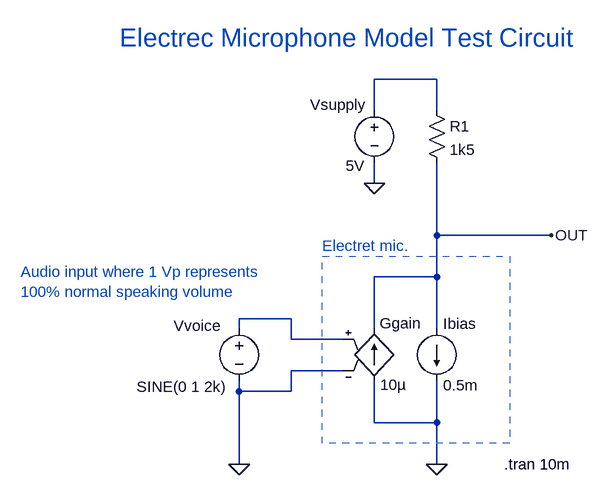
[diagram p0: schematic ElectretMicrophone.asc]
ElectretMicrophone.asc, the LTspice schematic file:
Version 4
SHEET 1 880 680
WIRE 192 -240 96 -240
WIRE 96 -192 96 -240
WIRE 192 -192 192 -240
WIRE 96 -80 96 -112
WIRE 192 0 192 -112
WIRE 368 0 192 0
WIRE 192 64 192 0
WIRE 192 64 96 64
WIRE -32 128 -112 128
WIRE -112 144 -112 128
WIRE 96 144 96 64
WIRE 192 144 192 64
WIRE -32 160 -32 128
WIRE 48 160 -32 160
WIRE 48 208 -32 208
WIRE -112 240 -112 224
WIRE -32 240 -32 208
WIRE -32 240 -112 240
WIRE 96 288 96 224
WIRE 192 288 192 224
WIRE 192 288 96 288
WIRE -112 352 -112 240
WIRE 192 352 192 288
FLAG 192 352 0
FLAG 368 0 OUT
FLAG -112 352 0
FLAG 96 -80 0
SYMBOL g 96 128 R0
WINDOW 0 8 7 Left 2
WINDOW 3 9 102 Left 2
SYMATTR InstName Ggain
SYMATTR Value 10µ
SYMBOL current 192 144 R0
WINDOW 0 10 -8 Left 2
WINDOW 3 10 87 Left 2
WINDOW 123 0 0 Left 0
WINDOW 39 0 0 Left 0
SYMATTR InstName Ibias
SYMATTR Value 0.5m
SYMBOL res 176 -208 R0
SYMATTR InstName R1
SYMATTR Value 1k5
SYMBOL voltage -112 128 R0
WINDOW 0 -101 11 Left 2
WINDOW 3 -158 105 Left 2
WINDOW 123 0 0 Left 0
WINDOW 39 0 0 Left 0
SYMATTR InstName Vvoice
SYMATTR Value SINE(0 1 2k)
SYMBOL voltage 96 -208 R0
WINDOW 0 -99 7 Left 2
WINDOW 3 -44 101 Left 2
WINDOW 123 0 0 Left 0
WINDOW 39 0 0 Left 0
SYMATTR InstName Vsupply
SYMATTR Value 5V
TEXT 296 352 Left 2 !.tran 10m
TEXT -296 -304 Left 4 ;Electrec Microphone Model Test Circuit
TEXT -448 56 Left 2 ;Audio input where 1 Vp represents \n100% normal speaking volume
TEXT 16 16 Left 2 ;Electret mic.
RECTANGLE Normal 304 320 16 32 2

The netlist it stands for:
* ElectretMicrophone.asc
Ggain 0 OUT N002 0 10µ
Ibias OUT 0 0.5m
R1 N001 OUT 1k5
Vvoice N002 0 SINE(0 1 2k)
Vsupply N001 0 5V
.tran 10m
* Electrec Microphone Model Test Circuit
* Audio input where 1 Vp represents
* 100% normal speaking volume
* Electret mic.
.backanno
.end